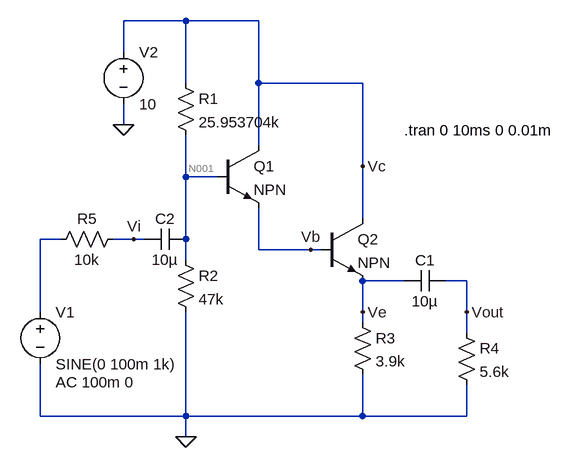
[diagram p0: schematic Darlington_Waveform.asc]
Darlington_Waveform.asc, the LTspice schematic file:
Version 4
SHEET 1 880 680
WIRE 80 -128 -16 -128
WIRE 192 -128 80 -128
WIRE -16 -80 -16 -128
WIRE 80 -32 80 -128
WIRE 192 -32 192 -128
WIRE 352 -32 192 -32
WIRE -16 32 -16 0
WIRE 192 64 192 -32
WIRE 352 96 352 -32
WIRE 80 112 80 48
WIRE 128 112 80 112
WIRE 352 176 352 96
WIRE -112 208 -144 208
WIRE 0 208 -32 208
WIRE 16 208 0 208
WIRE 80 208 80 112
WIRE 192 224 192 160
WIRE 272 224 192 224
WIRE 288 224 272 224
WIRE 80 240 80 208
WIRE 416 272 352 272
WIRE 512 272 480 272
WIRE -144 320 -144 208
WIRE 352 320 352 272
WIRE 512 320 512 272
WIRE 352 336 352 320
WIRE 512 352 512 320
WIRE -144 480 -144 400
WIRE 80 480 80 320
WIRE 80 480 -144 480
WIRE 352 480 352 416
WIRE 352 480 80 480
WIRE 512 480 512 432
WIRE 512 480 352 480
WIRE 80 512 80 480
FLAG 80 512 0
FLAG -16 32 0
FLAG 352 96 Vc
FLAG 272 224 Vb
FLAG 352 320 Ve
FLAG 512 320 Vout
FLAG 0 208 Vi
SYMBOL npn 128 64 R0
WINDOW 0 56 32 Left 2
WINDOW 3 56 68 Left 2
SYMATTR InstName Q1
SYMBOL npn 288 176 R0
WINDOW 0 56 32 Left 2
WINDOW 3 56 68 Left 2
SYMATTR InstName Q2
SYMBOL voltage -144 304 R0
WINDOW 123 24 124 Left 2
WINDOW 39 0 0 Left 0
SYMATTR InstName V1
SYMATTR Value SINE(0 100m 1k)
SYMATTR Value2 AC 100m 0
SYMBOL voltage -16 -96 R0
WINDOW 123 0 0 Left 0
WINDOW 39 0 0 Left 0
SYMATTR InstName V2
SYMATTR Value 10
SYMBOL res 64 -48 R0
WINDOW 0 36 40 Left 2
WINDOW 3 36 76 Left 2
SYMATTR InstName R1
SYMATTR Value 25.953704k
SYMBOL res 64 224 R0
WINDOW 0 36 40 Left 2
WINDOW 3 36 76 Left 2
SYMATTR InstName R2
SYMATTR Value 47k
SYMBOL res 336 320 R0
WINDOW 0 36 40 Left 2
WINDOW 3 36 76 Left 2
SYMATTR InstName R3
SYMATTR Value 3.9k
SYMBOL res 496 336 R0
WINDOW 0 36 40 Left 2
WINDOW 3 36 76 Left 2
SYMATTR InstName R4
SYMATTR Value 5.6k
SYMBOL res -16 192 R90
WINDOW 0 0 56 VBottom 2
WINDOW 3 32 56 VTop 2
SYMATTR InstName R5
SYMATTR Value 10k
SYMBOL cap 480 256 R90
WINDOW 0 0 32 VBottom 2
WINDOW 3 32 32 VTop 2
SYMATTR InstName C1
SYMATTR Value 10µ
SYMBOL cap 80 192 R90
WINDOW 0 0 32 VBottom 2
WINDOW 3 32 32 VTop 2
SYMATTR InstName C2
SYMATTR Value 10µ
TEXT 416 40 Left 2 !.tran 0 10ms 0 0.01m

The netlist it stands for:
* Darlington_Waveform.asc
Q1 Vc N001 Vb 0 NPN
Q2 Vc Vb Ve 0 NPN
V1 N002 0 SINE(0 100m 1k) AC 100m 0
V2 Vc 0 10
R1 Vc N001 25.953704k
R2 N001 0 47k
R3 Ve 0 3.9k
R4 Vout 0 5.6k
R5 Vi N002 10k
C1 Vout Ve 10µ
C2 N001 Vi 10µ
.model NPN NPN
.model PNP PNP
.lib standard.bjt
.tran 0 10ms 0 0.01m
.backanno
.end

* Results of the author's LTspice run, read from the files saved beside the schematic
* Operating Point, zero values left out:
*   V(vc) = 10 V
*   V(n001) = 6.44 V
*   V(vb) = 5.779 V
*   V(ve) = 4.999 V
*   Ic(Q2) = 1.269 mA
*   Ib(Q2) = 12.69 µA
*   Ie(Q2) = -1.282 mA
*   Ic(Q1) = 12.57 µA
*   Ib(Q1) = 125.6 nA
*   Ie(Q1) = -12.69 µA
*   I(R3) = 1.282 mA
*   I(R2) = 137 µA
*   I(R1) = 137.2 µA
*   I(V2) = -1.419 mA
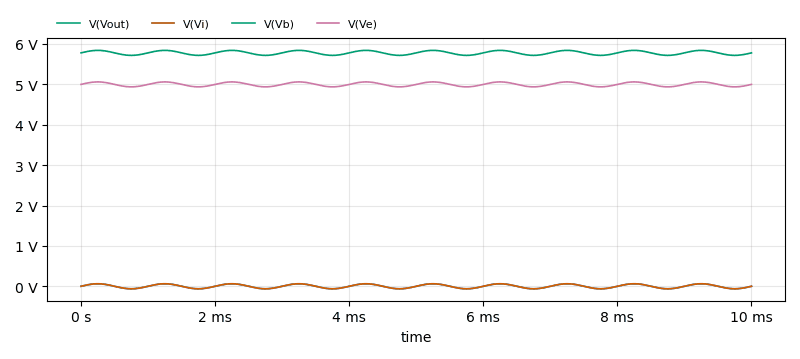
[diagram p1: Transient Analysis of Darlington_Waveform.asc, plotted from the saved traces]
* Transient Analysis, 1 run:
*   V(Vout): min -61.6 mV, max 61.24 mV, average -186.8 µV, rms 43.43 mV, last 34.46 µV
*   V(Vi): min -62.46 mV, max 62.51 mV, average 21.89 µV, rms 44.19 mV, last -823.7 nV
*   V(Vb): min 5.717 V, max 5.841 V, average 5.779 V, rms 5.779 V, last 5.779 V
*   V(Ve): min 4.937 V, max 5.06 V, average 4.999 V, rms 4.999 V, last 4.999 V